# EAGLE design TopBee2.2V (EAGLE 6.5.0)
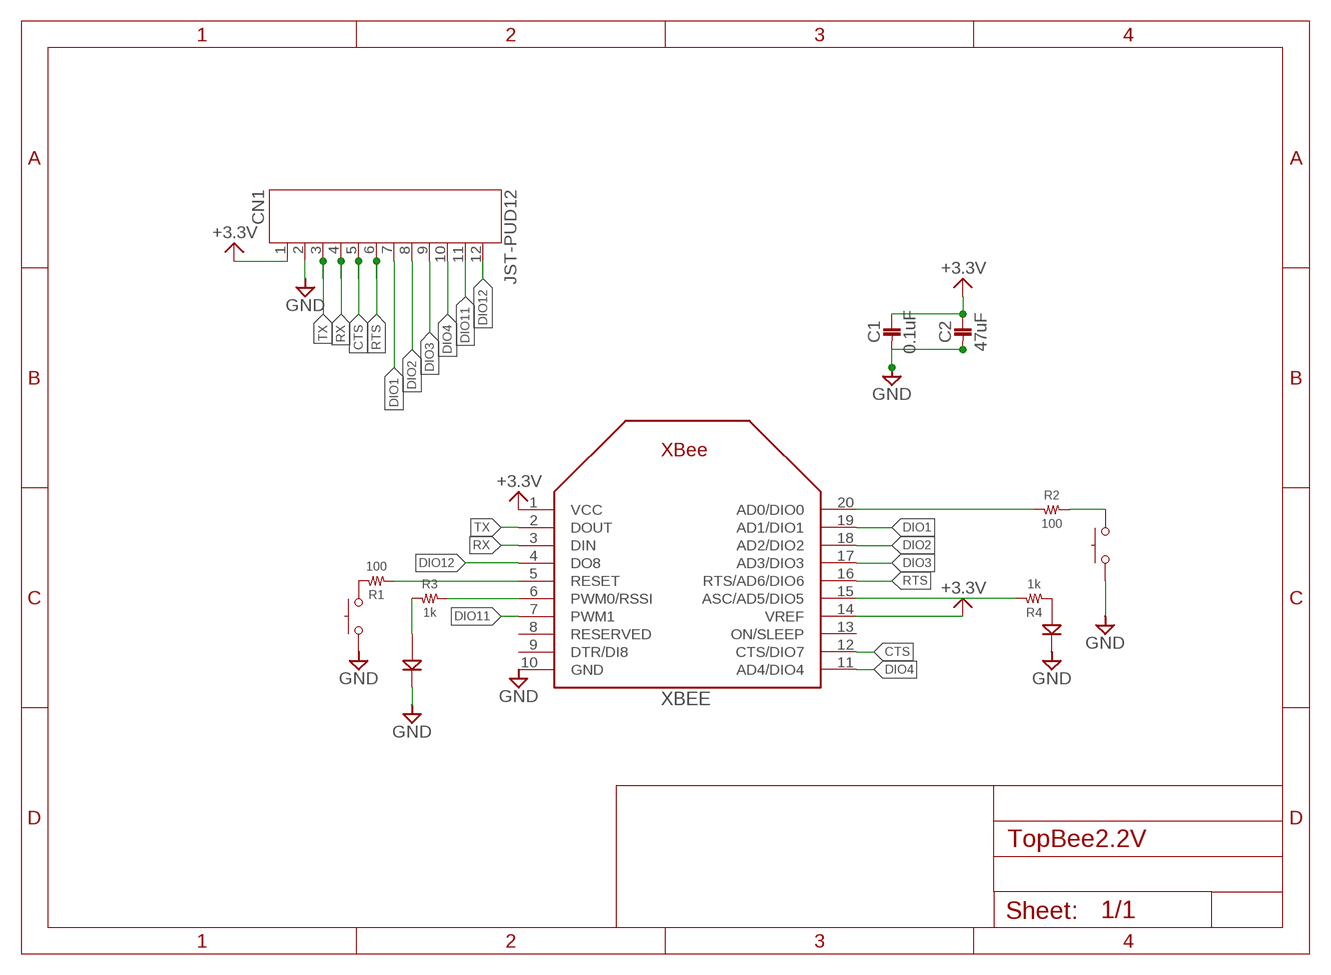
[diagram p0: schematic, sheet 1]

## Parts
C1  0.1uF  1608  [1608]
C2  47uF  3225  [3225]
CN1  JST-PUD12  [JST-PUD12]
COMM  SKRPACE010  [SKRP]
LEDB  1608  [1608]
LEDR  1608  [1608]
R1  100  RESISTOR__SMD  [1608]
R2  100  RESISTOR__SMD  [1608]
R3  1k  RESISTOR__SMD  [1608]
R4  1k  RESISTOR__SMD  [1608]
RESET  SKRPACE010  [SKRP]
XBEE  XBEE  [XBEE]

## Nets
+3.3V: C1.P$1 C2.P$1 CN1.1 XBEE.1(VCC) XBEE.14(VREF)
CTS: CN1.5 XBEE.12(CTS/DIO7)
DIO1: CN1.7 XBEE.19(AD1/DIO1)
DIO2: CN1.8 XBEE.18(AD2/DIO2)
DIO3: CN1.9 XBEE.17(AD3/DIO3)
DIO4: CN1.10 XBEE.11(AD4/DIO4)
DIO11: CN1.11 XBEE.7(PWM1)
DIO12: CN1.12 XBEE.4(DO8)
GND: C1.P$2 C2.P$2 CN1.2 COMM.3 COMM.4 LEDB.2(K) LEDR.2(K) RESET.3 RESET.4 XBEE.10(GND)
N$2: LEDR.1(A) R4.1
N$3: R2.1 XBEE.20(AD0/DIO0)
N$4: R1.1 XBEE.5(RESET)
N$5: R1.2 RESET.1 RESET.2
N$6: COMM.1 COMM.2 R2.2
N$7: R3.2 XBEE.6(PWM0/RSSI)
N$8: R4.2 XBEE.15(ASC/AD5/DIO5)
N$9: LEDB.1(A) R3.1
RTS: CN1.6 XBEE.16(RTS/AD6/DIO6)
RX: CN1.4 XBEE.3(DIN)
TX: CN1.3 XBEE.2(DOUT)
Unconnected: XBEE.8(RESERVED) XBEE.9(DTR/DI8) XBEE.13(ON/SLEEP)

## Library data of the parts
C1 = 02_C:1608
C2 = 02_C:3225
CN1 = jst-ph:JST-PUD12
COMM RESET = 09_1_switch:SKRPACE010
LEDB LEDR = 10_LED:1608
R1-R4 = 01_R:RESISTOR__SMD
XBEE = adafruit:XBEE

## Board
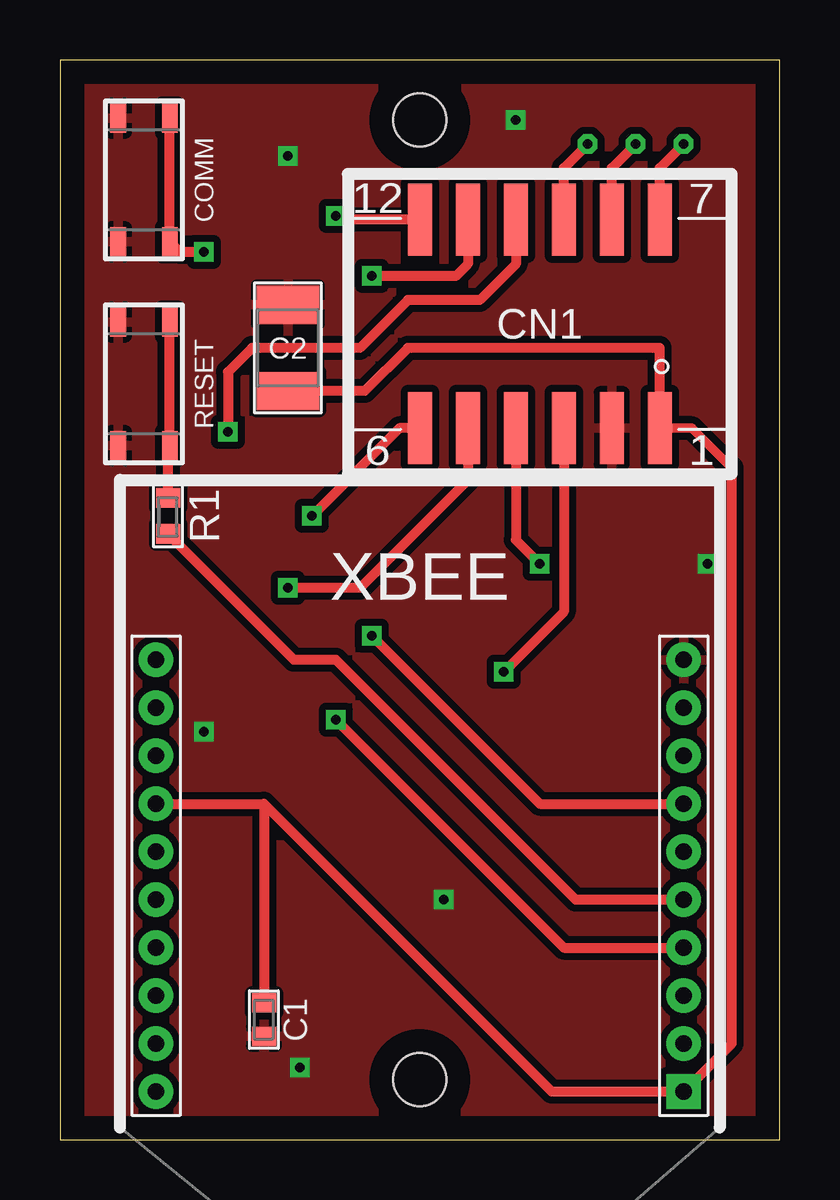
[diagram p1: board, top side]
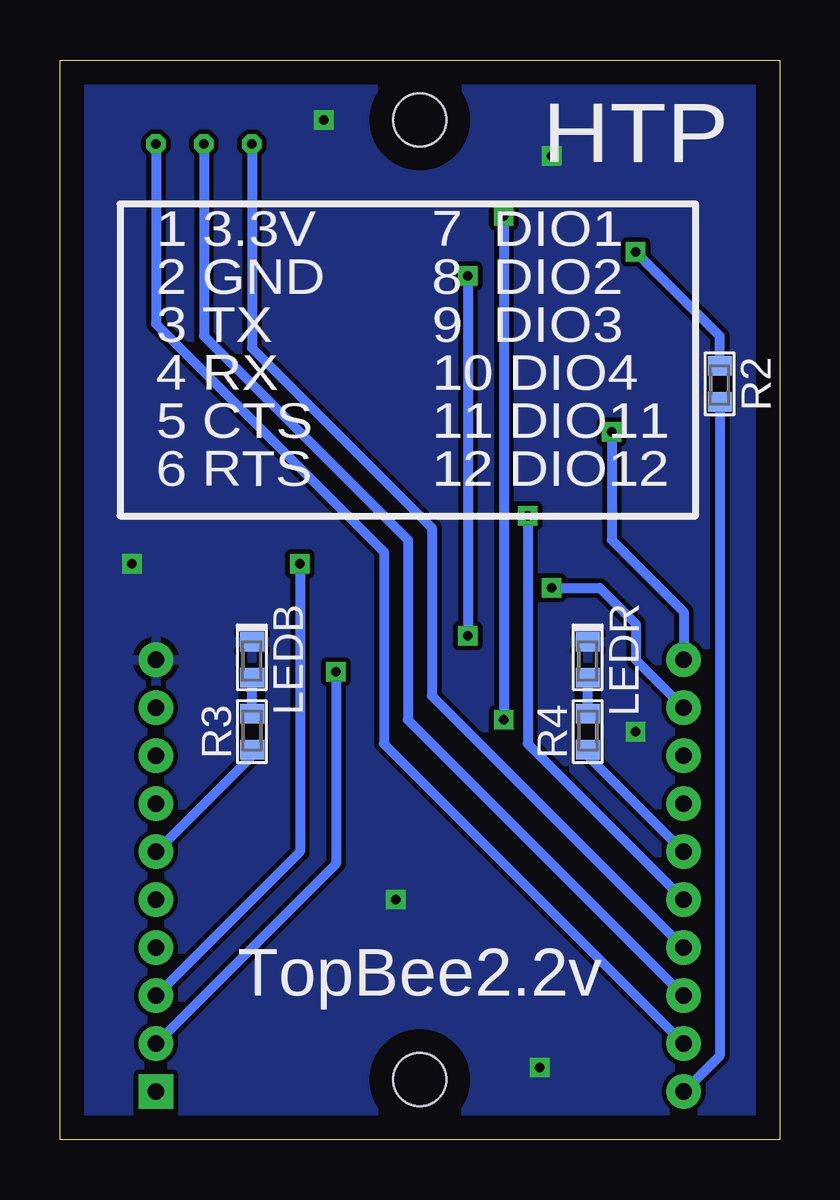
[diagram p2: board, bottom side, seen from below]

Size 30 x 45 mm. Coordinates in mm from the lower left corner, seen from the top.
Outline: 0,0 30,0 30,45 0,45 0,0
Copper layers (1*16): Top 0.035mm / dielectric 1.5mm / Bottom 0.035mm
Design rules "default *": minimum track width 10mil, minimum drill 0.3mm, track to track 8mil, track to pad 8mil, pad to pad 8mil, via to via 8mil, smd to smd 8mil, copper to edge 1mm, drill to drill 8mil, minimum pad ring 10mil, minimum via ring 8mil, stop-mask expansion 4mil, vias tented up to drill 0.4mm, thermal gap 10mil
Holes 2.2 mm at 15,2.5 15,42.5

### Footprints (pad centres in the part's own frame; a part is rotated, then mirrored left to right if it is on the bottom)
1608 = smd 0.8 x 1: P$1 -0.7,0; P$2 0.7,0
3225 = smd 1.6 x 2.6: P$1 -1.8,0; P$2 1.8,0
JST-PUD12 = smd 1 x 3: 1 5,-4.35; 2 3,-4.35; 3 1,-4.35; 4 -1,-4.35; 5 -3,-4.35; 6 -5,-4.35; 7 5,4.35; 8 3,4.35; 9 1,4.35; 10 -1,4.35; 11 -3,4.35; 12 -5,4.35
SKRP = smd 1.2 x 0.65: 1 -2.575,1.075; 2 2.575,1.075; 3 -2.575,-1.075; 4 2.575,-1.075
1608' = smd 0.8 x 1: 1 -0.75,0; 2 0.75,0
XBEE = drill 0.7 pad 1.422 square: 1 -11,5.5 | drill 0.7 pad 1.422: 2 -11,3.5; 3 -11,1.5; 4 -11,-0.5; 5 -11,-2.5; 6 -11,-4.5; 7 -11,-6.5; 8 -11,-8.5; 9 -11,-10.5; 10 -11,-12.5; 11 11,-12.5; 12 11,-10.5; 13 11,-8.5; 14 11,-6.5; 15 11,-4.5; 16 11,-2.5; 17 11,-0.5; 18 11,1.5; 19 11,3.5; 20 11,5.5

### Placement (x,y rotation side)
C1  8.5,5 270 top
C2  9.5,33 90 top
CN1  20,34 0 top
COMM  3.5,40 270 top
DRILEGEND  [DRILEGEND]  -5.45,-18.32 0 top  (outside the outline)
LEDB  1608  [1608']  22,20 90 bottom
LEDR  1608  [1608']  8,20 90 bottom
R1  100  [1608']  4.5,26 90 top
R2  100  [1608']  2.5,31.5 90 bottom
R3  1k  [1608']  22,17 270 bottom
R4  1k  [1608']  8,17 270 bottom
RESET  3.5,31.5 270 top
XBEE  15,7.5 180 top

### Tracks (layer width: path | path; a pad name or v marks a point on that pad's centre or on a via)
+3.3V
  Top 0.4: 28,28 26.35,29.65 CN1.1
  Top 0.406: CN1.1 25,33 14.5,33 12.7,31.2 C2.P$1 | XBEE.14 8.5,14 | 8.5,14 20.5,2 XBEE.1 28,4 28,28 | 8.5,14 C1.P$1
CTS  (via drill 0.4)
  Top 0.406: CN1.5 17,27.5 12.5,23 v9.5,23
  Bottom 0.406: v9.5,23 7.5,23 6,21.5 6,20 XBEE.12
DIO1  (via drill 0.4)
  Top 0.406: CN1.7 25,40.5 v26,41.5
  Bottom 0.406: v26,41.5 26,34 16.5,24.5 16.5,16.5 XBEE.19
DIO2  (via drill 0.4)
  Top 0.406: CN1.8 23,40.5 v24,41.5
  Bottom 0.406: v24,41.5 24,33.5 15.5,25 15.5,17.5 XBEE.18
DIO3  (via drill 0.4)
  Top 0.406: CN1.9 21,40.5 v22,41.5
  Bottom 0.406: v22,41.5 22,33 14.5,25.5 14.5,18.5 XBEE.17
DIO4  (via drill 0.4)
  Top 0.406: CN1.10 19,36.5 17.5,35 14.5,35 12.5,33 8,33 7,32 v7,29.5
  Bottom 0.406: v7,29.5 7,25 4,22 XBEE.11
DIO11  (via drill 0.4)
  Top 0.406: CN1.11 17,36.5 16.5,36 v13,36 | v13,21 20,14 XBEE.7
  Bottom 0.406: v13,36 v13,21
DIO12  (via drill 0.4)
  Top 0.406: CN1.12 11.85,38.35 v11.5,38.5 | v11.5,17.5 21,8 XBEE.4
  Bottom 0.406: v11.5,38.5 v11.5,17.5
GND  (via drill 0.4)
  other vias: 19,42.5 9.5,41 6,17 10,3 16,10 27,24
  pour Top (isolate 0.3): 0,45 30,45 30,0 0,0
  pour Bottom (isolate 0.2): 0,45 30,45 30,0 0,0
N$2
  Bottom 0.406: R4.1 LEDR.1
N$3
  Bottom 0.406: R2.1 2.5,3.5 XBEE.20
N$4
  Top 0.406: XBEE.5 21.5,10 11.5,20 9.75,20 R1.1
N$5
  Top 0.406: R1.2 4.5,28.85 RESET.2 RESET.1
N$6  (via drill 0.4)
  Top 0.406: v6,37 5,37 COMM.2 COMM.1
  Bottom 0.406: R2.2 2.5,33.5 v6,37
N$7
  Bottom 0.406: R3.2 22,16 XBEE.6
N$8
  Bottom 0.406: XBEE.15 8,16 R4.2
N$9
  Bottom 0.406: R3.1 LEDB.1
RTS  (via drill 0.4)
  Top 0.406: v10.5,26 14.15,29.65 CN1.6
  Bottom 0.406: v10.5,26 10.5,16.5 XBEE.16
RX  (via drill 0.4)
  Top 0.406: CN1.4 19,25 v20,24
  Bottom 0.406: v20,24 20,12 XBEE.3
TX  (via drill 0.4)
  Top 0.406: CN1.3 21,22 v18.5,19.5
  Bottom 0.406: v18.5,19.5 18.5,11.5 XBEE.2

### Text on the board
tPlace: 12 | 7 | 6 | 1
bPlace: HTP | 7 DIO1 | 1 3.3V | 8 DIO2 | 2 GND | 9 DIO3 | 3 TX | 10 DIO4 | 4 RX | 11 DIO11 | 5 CTS | 12 DIO12 | 6 RTS | TopBee2.2v